# Altium schematic sheet HMI_MINI.SchDoc: HMI MINI
size A3; SheetNumber: 1; SheetTotal: 1
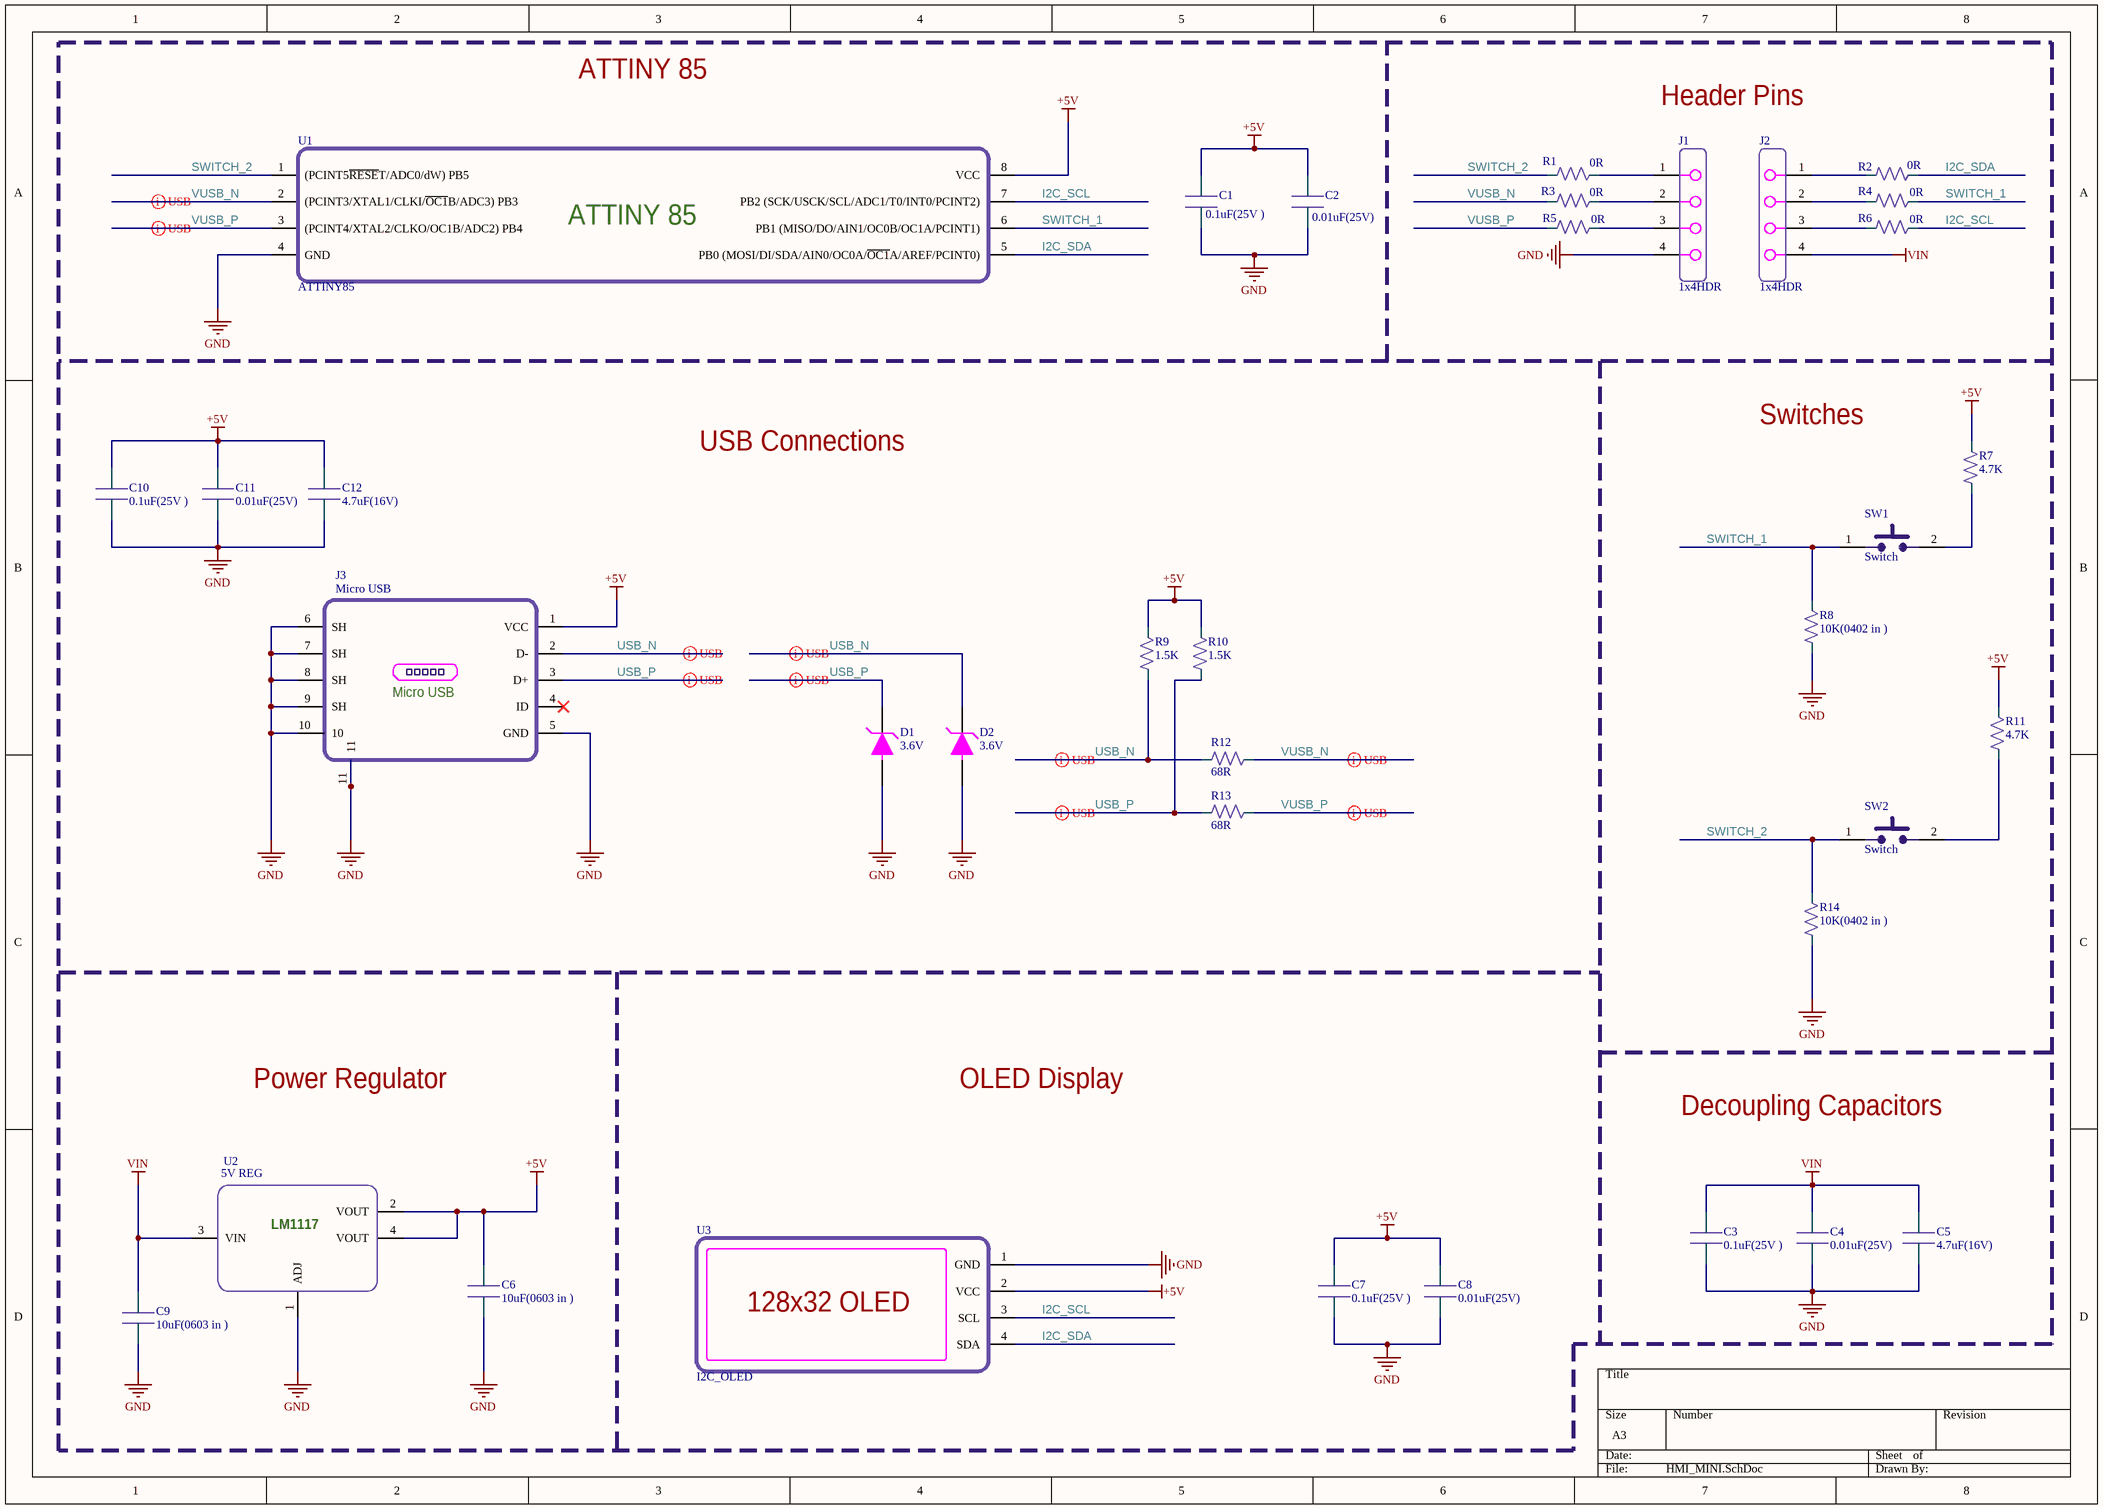
[diagram p0: HMI_MINI.SchDoc]

## Parts
C1  0.1uF(25V )  [CAPACITOR_0402]
C2  0.01uF(25V)  [CAPACITOR_0402]
C3  0.1uF(25V )  [CAPACITOR_0402]
C4  0.01uF(25V)  [CAPACITOR_0402]
C5  4.7uF(16V)  [CAPACITOR_0402]
C6  10uF(0603 in )  [Capacitor_0603]
C7  0.1uF(25V )  [CAPACITOR_0402]
C8  0.01uF(25V)  [CAPACITOR_0402]
C9  10uF(0603 in )  [Capacitor_0603]
C10  0.1uF(25V )  [CAPACITOR_0402]
C11  0.01uF(25V)  [CAPACITOR_0402]
C12  4.7uF(16V)  [CAPACITOR_0402]
D1  3.6V  [SOD323_ZENER]
D2  3.6V  [SOD323_ZENER]
J1  1x4HDR  [P2.541X4HDR]
J2  1x4HDR  [P2.541X4HDR]
J3  Micro USB  [TE_1981568-1]
R1  0R  [RESISTOR_0402]
R2  0R  [RESISTOR_0402]
R3  0R  [RESISTOR_0402]
R4  0R  [RESISTOR_0402]
R5  0R  [RESISTOR_0402]
R6  0R  [RESISTOR_0402]
R7  4.7K  [RESISTOR_0402]
R8  10K(0402 in )  [RESISTOR_0402]
R9  1.5K  [RESISTOR_0402]
R10  1.5K  [RESISTOR_0402]
R11  4.7K  [RESISTOR_0402]
R12  68R  [RESISTOR_0402]
R13  68R  [RESISTOR_0402]
R14  10K(0402 in )  [RESISTOR_0402]
SW1  Switch  [Switch_2Lead]
SW2  Switch  [Switch_2Lead]
U1  ATTINY85  [SOIC127P798X216-8N]
U2  5V REG  [4PIN-SOT]
U3  I2C_OLED  [128x32 OLED]

## Nets
+5V: C1.2 C2.2 C6.2 C7.2 C8.2 C10.2 C11.2 C12.2 J3.1(VCC) R7.2 R9.2 R10.2 R11.2 U1.8(VCC) U2.2(VOUT) U2.4(VOUT) U3.2(VCC)
GND: C1.1 C2.1 C3.1 C4.1 C5.1 C6.1 C7.1 C8.1 C9.1 C10.1 C11.1 C12.1 D1.1 D2.1 J1.4 J3.5(GND) J3.6(SH) J3.7(SH) J3.8(SH) J3.9(SH) J3.10 J3.11 R8.1 R14.1 U1.4(GND) U2.1(ADJ) U3.1(GND)
VIN: C3.2 C4.2 C5.2 C9.2 J2.4 U2.3(VIN)
I2C_SCL: R6.2 U1.7(PB2_(SCK/USCK/SCL/ADC1/T0/INT0/PCINT2)) U3.3(SCL)
I2C_SDA: R2.2 U1.5(PB0_(MOSI/DI/SDA/AIN0/OC0A/~{OC1}A/AREF/PCINT0)) U3.4(SDA)
SWITCH_1: R4.2 R8.2 SW1.1 U1.6(PB1_(MISO/DO/AIN1/OC0B/OC1A/PCINT1))
SWITCH_2: R1.1 R14.2 SW2.1 U1.1((PCINT5~{RESE}T/ADC0/dW)_PB5)
USB_N: D2.2 J3.2(D-) R9.1 R12.1
USB_P: D1.2 J3.3(D+) R10.1 R13.1
VUSB_N: R3.1 R12.2 U1.2((PCINT3/XTAL1/CLKI/~{OC1}B/ADC3)_PB3)
VUSB_P: R5.1 R13.2 U1.3((PCINT4/XTAL2/CLKO/OC1B/ADC2)_PB4)
NetJ1_1: J1.1 R1.2
NetJ1_2: J1.2 R3.2
NetJ1_3: J1.3 R5.2
NetJ2_1: J2.1 R2.1
NetJ2_2: J2.2 R4.1
NetJ2_3: J2.3 R6.1
NetR7_1: R7.1 SW1.2
NetR11_1: R11.1 SW2.2

Not connected (* = marked no-connect by the designer): J3 4(ID)*

## Layout directives
differential pair; net class USB: USB_N, USB_P, VUSB_N, VUSB_P

## Notes on the sheet
- ATTINY 85
- Header Pins
- USB Connections
- Switches
- Power Regulator
- OLED Display
- Decoupling Capacitors
- (in symbol ATTINY85V-10SU) ATTINY 85
- (in symbol I2COLED) 128x32 OLED
- (in symbol LM1117IMP-5.0/NOPB) LM1117

## Library data of the parts
C1 C3 C7 C10 = GRM155R71E104KE14J: 0.1µF ±10% 25V Ceramic Capacitor X7R 0402 (1005 Metric); Manufacturer: Murata Electronics; MinTemp: -55°C; MaxTemp: 125°C; ManufacturerPartNumber: GRM155R71E104KE14J; SupplierPartNumber: 490-14603-1-ND; Supplier: Digikey; PartStatus: Active; Price: 0.10; ComponentLink1Description: SupplierURL; ComponentLink1URL: https://www.digikey.com/en/products/detail/murata-electronics/GRM155R71E104KE14J/4905174
C2 C4 C8 C11 = C0402C103J3RACTU: 10000pF ±5% 25V Ceramic Capacitor X7R 0402 (1005 Metric); Manufacturer: KEMET; MinTemp: -55°C; MaxTemp: 125°C; ManufacturerPartNumber: C0402C103J3RACTU; SupplierPartNumber: 399-1279-1-ND; Supplier: Digikey; PartStatus: Active; Price: 0.10; ComponentLink1Description: SupplierURL; ComponentLink1URL: https://www.digikey.com/en/products/detail/kemet/C0402C103J3RACTU/416042
C5 C12 = 0402YD475MAT2A: 4.7µF ±20% 16V Ceramic Capacitor X5R 0402 (1005 Metric); Manufacturer: AVX Corporation; MinTemp: -55°C; MaxTemp: 85°C; ManufacturerPartNumber: 0402YD475MAT2A; SupplierPartNumber: 478-10788-1-ND; PartStatus: Active; Price: 0.29; ComponentLink1Description: SupplierURL; ComponentLink1URL: https://www.digikey.com/en/products/detail/avx-corporation/0402YD475MAT2A/6221357; Supplier: Digikey
C6 C9 = GRM188R61E106KA73D: 10µF ±10% 25V Ceramic Capacitor X5R 0603 (1608 Metric); Manufacturer: Murata Electronics; MinTemp: -55°C; MaxTemp: 85°C; ManufacturerPartNumber: GRM188R61E106KA73D; SupplierPartNumber: 490-18214-1-ND; PartStatus: Active; Price: 0.32; ComponentLink1Description: SupplierURL; ComponentLink1URL: https://www.digikey.com/en/products/detail/murata-electronics/GRM188R61E106KA73D/9867922; Supplier: Digikey
D1 D2 = BZM55B3V6-TR: Zener Diode 3.6V 500mW  Surface Mount MicroMELF; Manufacturer: Vishay General Semiconductor - Diodes Division; MinTemp: -65°C; MaxTemp: 175°C; ManufacturerPartNumber: BZM55B3V6-TR; SupplierPartNumber: 112-BZM55B3V6-CT-ND; Supplier: Digikey; PartStatus: Active; Price: 0.28; ComponentLink1Description: SupplierURL; ComponentLink1URL: https://www.digikey.com/en/products/detail/vishay-general-semiconductor-diodes-division/BZM55B3V6-TR/4830627
J1 J2 = PEC04SAAN: Connector Header Through Hole 4 position 0.100" (2.54mm); Maanufacturer: Sullins Connector Solutions; MinTemp: -65°C; MaxTemp: 125°C; ManufacturerPartNumber: PEC04SAAN; SupplierPartNumber: S1012E-04-ND; Supplier: Digikey; PartStatus: Active; Price: 0.27; ComponentLink1Description: SupplierURL; ComponentLink1URL: https://www.digikey.com/en/products/detail/sullins-connector-solutions/PEC04SAAN/859157
J3 = 1981568-1: USB - micro B USB 2.0 Receptacle Connector 5 Position Surface Mount, Right Angle; Manufacturer: TE Connectivity AMP Connectors; MinTemp: -30°C; MaxTemp: 85°C; ManufacturerPartNumber: 1981568-1; SupplierPartNumber: A97800CT-ND; Supplier: Digikey; PartStatus: Active; Price: 1.71; ComponentLink1Description: SupplierURL; ComponentLink1URL: https://www.digikey.com/en/products/detail/te-connectivity-amp-connectors/1981568-1/1786248
R1-R6 = CR0402AJ/-000GAS: Jumper 0.063W, 1/16W Chip Resistor 0402 (1005 Metric) Anti-Sulfur, Automotive AEC-Q200, Moisture Resistant Thick Film; Manufacturer: Bourns Inc.; MinTemp: -55°C; MaxTemp: 155°C; ManufacturerPartNumber: CR0402AJ/-000GAS; SupplierPartNumber: CR0402AJ/-000GASCT-ND; Supplier: Digikey; PartStatus: Active; Price: 0.10; ComponentLink1Description: SupplierURL; ComponentLink1URL: https://www.digikey.com/en/products/detail/bourns-inc/CR0402AJ-000GAS/10240110
R7 R11 = ERJ-U02J472X: 4.7 kOhms ±5% 0.1W, 1/10W Chip Resistor 0402 (1005 Metric) Anti-Sulfur, Automotive AEC-Q200 Thick Film; Manufacturer: Panasonic Electronic Components; MinTemp: -55°C; MaxTemp: 155°C; ManufacturerPartNumber: ERJ-U02J472X; SupplierPartNumber: 10-ERJ-U02J472XCT-ND; Supplier: Digikey; PartStatus: Active; Price: 0.10; ComponentLink1Description: SupplierURL; ComponentLink1URL: https://www.digikey.com/en/products/detail/panasonic-electronic-components/ERJ-U02J472X/11631055
R8 R14 = ERJ-U02J103X: 10 kOhms ±5% 0.1W, 1/10W Chip Resistor 0402 (1005 Metric) Anti-Sulfur, Automotive AEC-Q200 Thick Film; Manufacturer: Panasonic Electronic Components; MinTemp: -55°C; MaxTemp: 155°C; ManufacturerPartNumber: ERJ-U02J103X; SupplierPartNumber: 10-ERJ-U02J103XCT-ND; PartStatus: Active; Price: 0.10; ComponentLink1Description: SupplierURL; ComponentLink1URL: https://www.digikey.com/en/products/detail/panasonic-electronic-components/ERJ-U02J103X/11631335; Supplier: Digikey
R9 R10 = ERJ-U02J152X: 1.5 kOhms ±5% 0.1W, 1/10W Chip Resistor 0402 (1005 Metric) Anti-Sulfur, Automotive AEC-Q200 Thick Film; Manufacturer: Panasonic Electronic Components; MinTemp: -55°C; MaxTemp: 155°C; ManufacturerPartNumber: ERJ-U02J152X; SupplierPartNumber: 10-ERJ-U02J152XCT-ND; Supplier: Digikey; PartStatus: Active; Price: 0.10; ComponentLink1Description: SupplierURL; ComponentLink1URL: https://www.digikey.com/en/products/detail/panasonic-electronic-components/ERJ-U02J152X/11634723
R12 R13 = CRGCQ0402J68R: 68 Ohms ±5% 0.063W, 1/16W Chip Resistor 0402 (1005 Metric) Automotive AEC-Q200, Moisture Resistant Thick Film; Manufacturer: TE Connectivity Passive Product; MinTemp: -55°C; MaxTemp: 155°C; ManufacturerPartNumber: CRGCQ0402J68R; SupplierPartNumber: A130041CT-ND; Supplier: Digikey; PartStatus: Active; Price: 0.10; ComponentLink1Description: SupplierURL; ComponentLink1URL: https://www.digikey.com/en/products/detail/te-connectivity-passive-product/CRGCQ0402J68R/8576643
SW1 SW2 = PTS636 SK50 SMTR LFS: Tactile Switch SPST-NO Top Actuated Surface Mount; Manufacturer: C&K; MinTemp: -20°C; MaxTemp: 70°C; ManufacturerPartNumber: PTS636 SK50 SMTR LFS; SupplierPartNumber: CKN12315-1-ND; Supplier: Digikey; PartStatus: Active; Price: 0.12; ComponentLink1Description: SupplierURL; ComponentLink1URL: https://www.digikey.com/en/products/detail/c-k/PTS636-SK50-SMTR-LFS/10071728
U1 = ATTINY85V-10SU: AVR series Microcontroller IC 8-Bit 10MHz 8KB (4K x 16) FLASH 8-SOIC; Manufacturer: Microchip Technology; PartSatus: Active; MinTemp: -40°C; MaxTemp: 85°C; ManufacturerPartNumber: ATTINY85V-10SU; SupplierPartNumber: ATTINY85V-10SU-ND; Supplier: Digikey; Price: 1.31; ComponentLink1Description: SupplierURL; ComponentLink1URL: https://www.digikey.com/en/products/detail/microchip-technology/ATTINY85V-10SU/735472
U2 = LM1117IMP-5.0/NOPB: Linear Voltage Regulator IC Positive Fixed 1 Output  800mA SOT-223; Manufacturer: Texas Instruments; MinTemp: -40°C; MaxTemp: 125°C; ManufacturerPartNumber: LM1117IMP-5.0/NOPB; SupplierPartNumber: LM1117IMP-5.0/NOPBCT-ND; Supplier: Digikey; PartStatus: Active; Price: 1.17; ComponentLink1Description: SupplierURL; ComponentLink1URL: https://www.digikey.com/en/products/detail/texas-instruments/LM1117IMP-5-0-NOPB/482940
U3 = I2COLED: ComponentLink1Description: SupplierURL; ComponentLink1URL: https://www.amazon.in/xcluma-Display-SSD1306-Driver-Module/dp/B07966FNMN